# Altium schematic sheet Sheet2_Power.SchDoc: JJGEEX_Homie_POC1
size Legal; Author: Jonas Cooper; CompanyName: JJ-GEEX; DrawnBy: Jonas Cooper; Organization: Homie Secure Smarthome; Address1: -; Address2: CU Boulder ECEE; Address3: -; Address4: Capstone; DocumentNumber: 1; Revision: 1; SheetNumber: 2; SheetTotal: 4
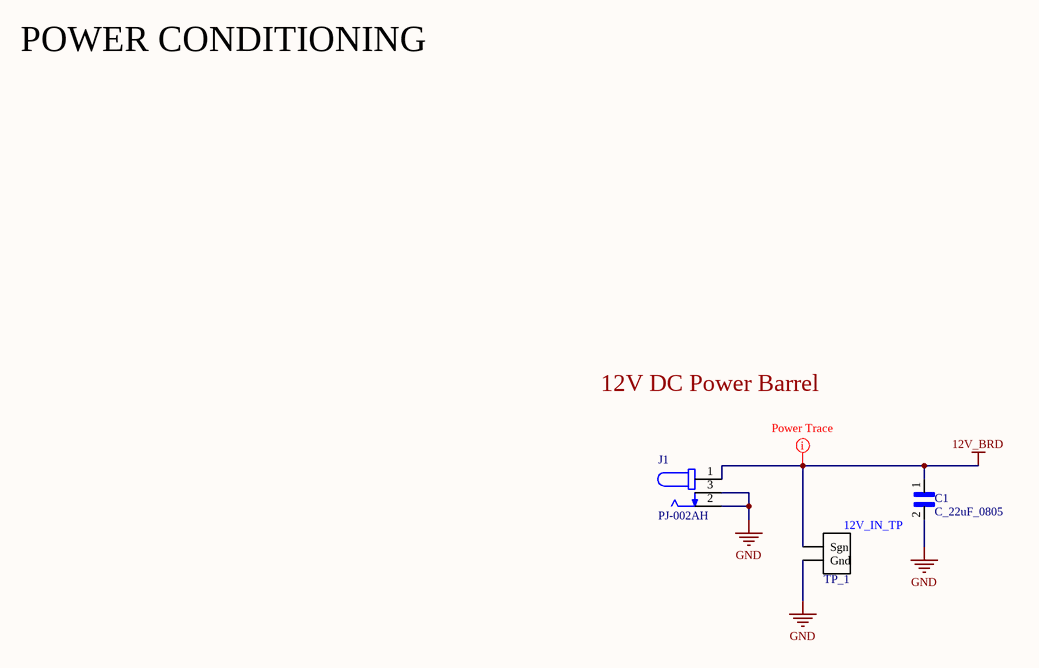
[diagram p0: Sheet2_Power.SchDoc]

## Parts
C1  C_22uF_0805  [CAPC2012X140N]
J1  PJ-002AH  [CUI_PJ-002AH]
TP_1  10x Probe TP  [TP10x_Probe]  (value not drawn)

## Nets
12V_BRD: C1.1 J1.1 TP_1.1(Sgn)
GND: C1.2 J1.2 J1.3 TP_1.2(Gnd)

## Layout directives
rule Width Constraint [Pref Width = 13mil    Min Width = 6mil    Max Width = 100mil]: 12V_BRD

## Notes on the sheet
- POWER CONDITIONING
- 12V DC Power Barrel
- 12V_IN_TP
- Title
- Size:
- Date:
- Legal
- Number:
- Time:
- Revision:
- Sheet
- of
- File:

## Library data of the parts
C1 = C_22uF_0805: 22µF 0805 ±20% 25V Ceramic Capacitor X5R 0805 (2012 Metric); MF: Samsung; MP: CL21A226MAQNNNE; SnapEDA_Link: https://www.snapeda.com/parts/CL21A226MAQNNNE/Samsung%20Electro-Mechanics/view-part/620487/?ref=snap; Check_prices: https://www.snapeda.com/parts/CL21A226MAQNNNE/Samsung%20Electro-Mechanics/view-part/620487/?ref=eda; Digi-Key_Part_Number: 1276-2908-1-ND; Value: *; Package: 0805 Samsung; Purchase-URL: https://pricing.snapeda.com/search/part/CL21A226MAQNNNE/?ref=eda; LCSC#: C45783
J1 = PJ-002AH: 2.0 x 6.5 mm, 5.0 A, Horizontal, Through Hole, Dc Power Jack Connector; MF: CUI Devices; MP: PJ-002AH; Package: None; Value: *; Digi-Key_Purchase_URL: https://www.digikey.com/product-detail/en/cui-devices/PJ-002AH/CP-002AH-ND/408446?utm_source=snapeda&utm_medium=aggregator&utm_campaign=symbol; Digi-Key_Part_Number: CP-002AH-ND; SnapEDA_Link: https://www.snapeda.com/parts/PJ-002AH/CUI%20Devices/view-part/448876/?ref=snap; CUI_purchase_URL: https://www.cuidevices.com/product/interconnect/connectors/dc-power-connectors/jacks/pj-002ah?utm_source=snapeda.com&utm_medium=referral&utm_campaign=snapedaBOM
TP_1 = TP_10x_Probe: Test Point 300 mil centers